# Altium schematic sheet TopSheet.SchDoc
size A4; CompanyName: Technische Hochschule Nürnberg Georg Simon Ohm; Address1: Fürther Straße 250; Address2: 90429 Nürnberg; Address3: GERMANY; DocumentNumber: 1; SheetNumber: 1; SheetTotal: 2; CompanyName2: Institut ELSYS
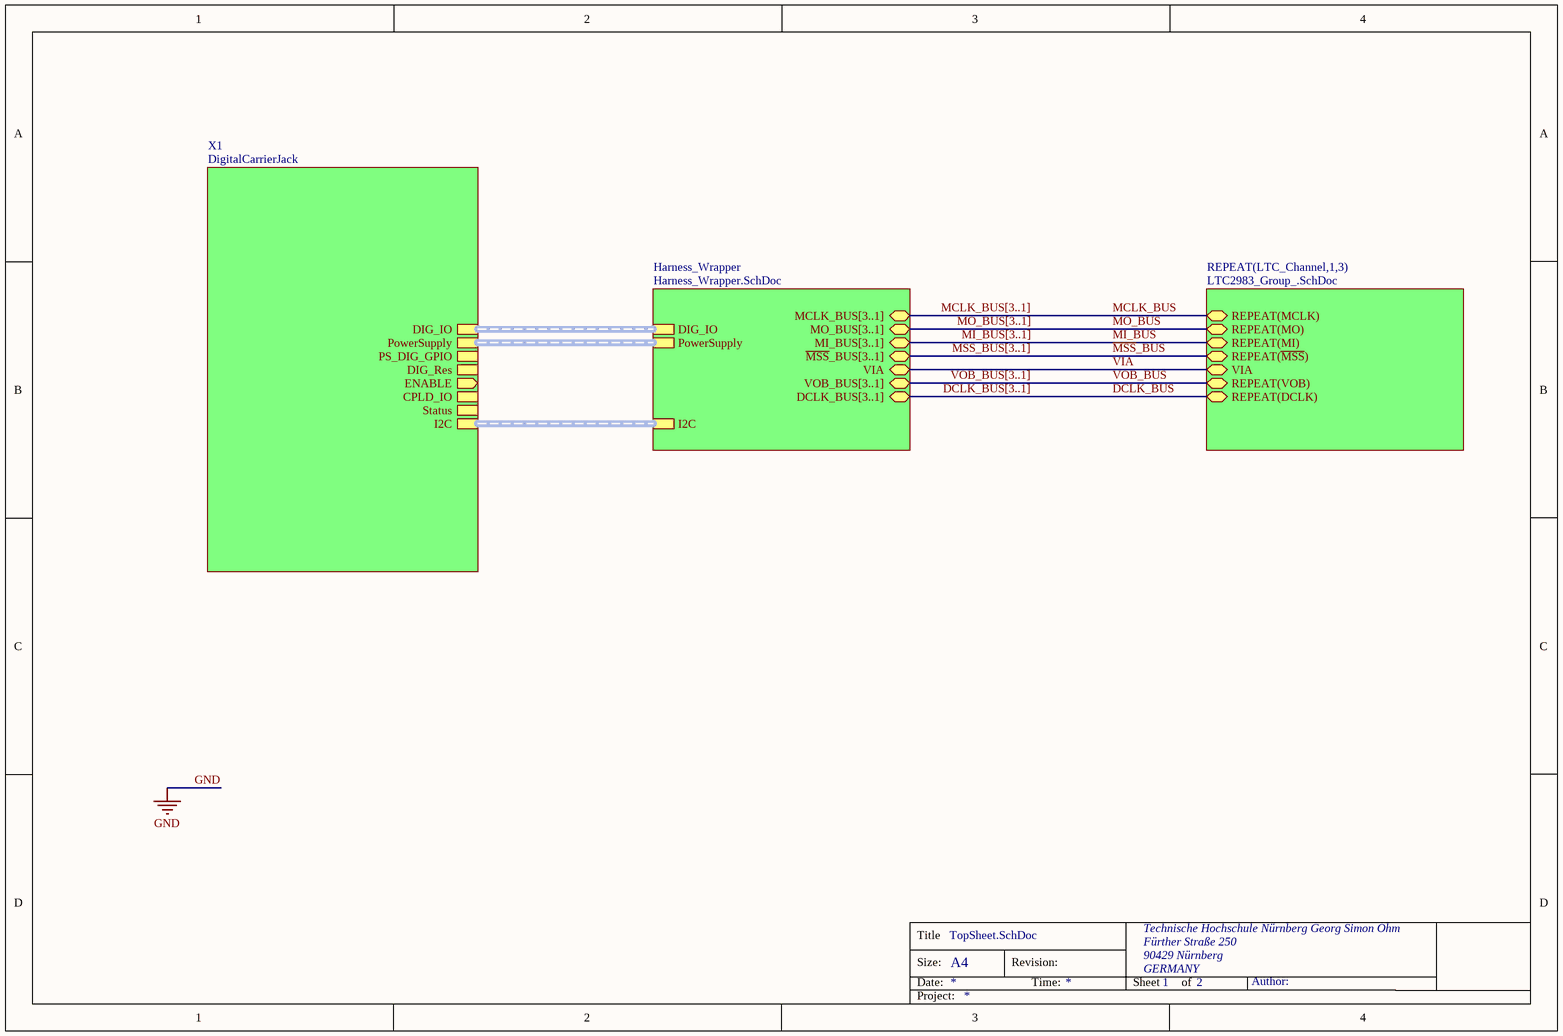
[diagram p0: TopSheet.SchDoc]

## Sub-sheets
Harness_Wrapper = Harness_Wrapper.SchDoc: DIG_IO (harness DigCon_DIG_IO), PowerSupply (harness DigCon_PowerSupply), I2C (harness DigCon_I2C), MCLK_BUS[3..1] (bidir), MO_BUS[3..1] (bidir), MI_BUS[3..1] (bidir), ~{MSS}_BUS[3..1] (bidir), VIA (bidir), VOB_BUS[3..1] (bidir), DCLK_BUS[3..1] (bidir)
REPEAT(LTC_Channel,1,3) = LTC2983_Group_.SchDoc: REPEAT(MCLK) (bidir), REPEAT(MO) (bidir), REPEAT(MI) (bidir), REPEAT(~{MSS}) (bidir), VIA (bidir), REPEAT(VOB) (bidir), REPEAT(DCLK) (bidir)
X1 = DigitalCarrierJack: DIG_IO (harness DigCon_DIG_IO), PowerSupply (harness DigCon_PowerSupply), PS_DIG_GPIO (harness DigCon_PS_DIG_GPIO), DIG_Res (harness DigCon_DIG_Res), ENABLE (out), CPLD_IO (harness DigCon_DCPLD_IO), Status (harness DigCon_Status), I2C (harness DigCon_I2C)

## Nets
DCLK_BUS: sheet REPEAT(LTC_Channel,1,3)/REPEAT(DCLK)
~{MSS}_BUS: sheet REPEAT(LTC_Channel,1,3)/REPEAT(~{MSS})
MCLK_BUS: sheet REPEAT(LTC_Channel,1,3)/REPEAT(MCLK)
MI_BUS: sheet REPEAT(LTC_Channel,1,3)/REPEAT(MI)
MO_BUS: sheet REPEAT(LTC_Channel,1,3)/REPEAT(MO)
VIA: sheet REPEAT(LTC_Channel,1,3)/VIA, sheet Harness_Wrapper/VIA
VOB_BUS: sheet REPEAT(LTC_Channel,1,3)/REPEAT(VOB)

## Buses and harness runs
bus DCLK_BUS[3..1] = sheet Harness_Wrapper/DCLK_BUS[3..1]
bus MCLK_BUS[3..1] = sheet Harness_Wrapper/MCLK_BUS[3..1]
bus MI_BUS[3..1] = sheet Harness_Wrapper/MI_BUS[3..1]
bus MO_BUS[3..1] = sheet Harness_Wrapper/MO_BUS[3..1]
bus VOB_BUS[3..1] = sheet Harness_Wrapper/VOB_BUS[3..1]
bus ~{MSS}_BUS[3..1] = sheet Harness_Wrapper/~{MSS}_BUS[3..1]
harness sheet Harness_Wrapper/DIG_IO = sheet X1/DIG_IO
harness sheet Harness_Wrapper/I2C = sheet X1/I2C
harness sheet Harness_Wrapper/PowerSupply = sheet X1/PowerSupply

## Notes on the sheet
- Title
- Size:
- Date:
- A4
- Revision:
- Time:
- Sheet
- of
- Author:
- Project: